# Altium schematic sheet leo_RPI_BUCK.SchDoc
size A; SheetNumber: 4; SheetTotal: 6
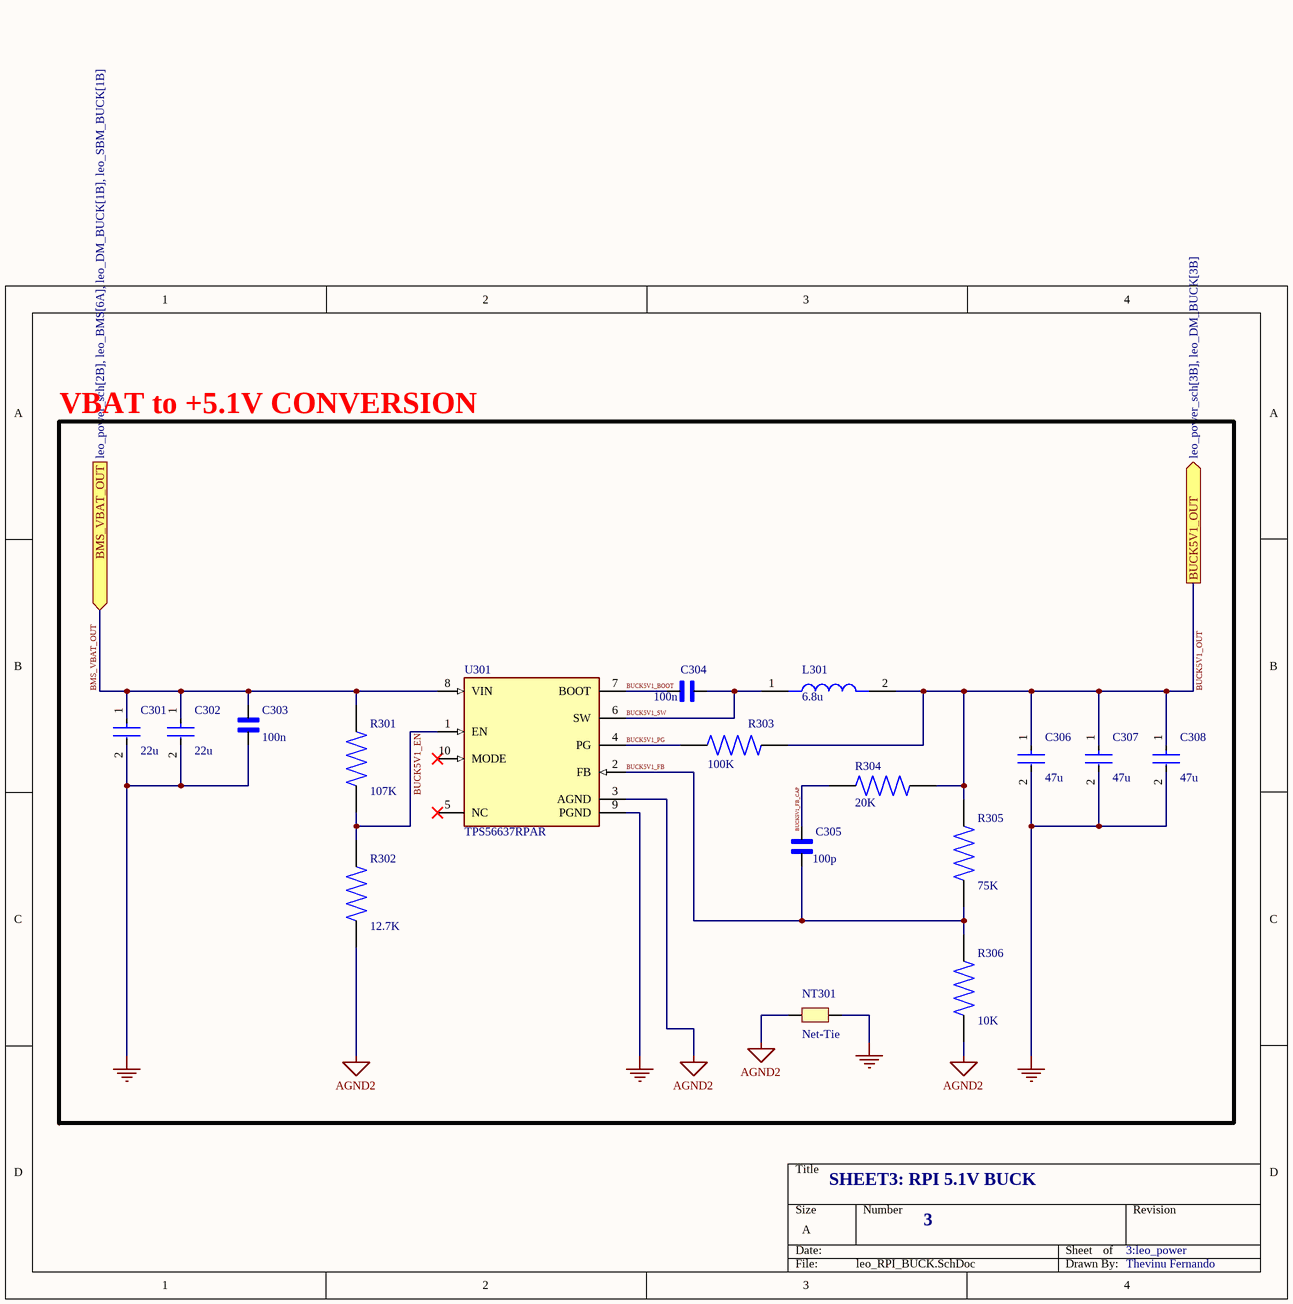
[diagram p0: leo_RPI_BUCK.SchDoc]

## Parts
C301  22u  [CAP_1206]
C302  22u  [CAP_1206]
C303  100n  [CAP_0603]
C304  100n  [CAP_0402]
C305  100p  [CAP_0402]
C306  47u  [CAP_1206]
C307  47u  [CAP_1206]
C308  47u  [CAP_1206]
L301  6.8u  [IND_104CDMCCDS-8R2MC]
NT301  Net-Tie  [NET-TIE_SMD]  (net tie, no BOM)
R301  107K  [RES_0603]
R302  12.7K  [RES_0603]
R303  100K  [RES_0402]
R304  20K  [RES_0402]
R305  75K  [RES_0603]
R306  10K  [RES_0603]
U301  TPS56637RPAR  [FP-RPA0010A-MFG]

## Blocks framed on the sheet
VBAT to +5.1V CONVERSION: C301-C308 L301 NT301 R301-R306 U301

## Ports
BMS_VBAT_OUT (in, see leo_power_sch[2B], leo_BMS[6A], leo_DM_BUCK[1B], leo_SBM_BUCK[1B]), BUCK5V1_OUT (out, see leo_power_sch[3B], leo_DM_BUCK[3B])

## Nets
AGND2: NT301.2 R302.1 R306.1 U301.3(AGND)
GND: C301.2 C302.2 C303.1 C306.2 C307.2 C308.2 NT301.1 U301.9(PGND)
BMS_VBAT_OUT: C301.1 C302.1 C303.2 R301.2 U301.8(VIN) ; port BMS_VBAT_OUT
BUCK5V1_BOOT: C304.1 U301.7(BOOT)
BUCK5V1_EN: R301.1 R302.2 U301.1(EN)
BUCK5V1_FB: C305.1 R305.1 R306.2 U301.2(FB)
BUCK5V1_FB_CAP: C305.2 R304.1
BUCK5V1_OUT: C306.1 C307.1 C308.1 L301.2 R303.2 R304.2 R305.2 ; port BUCK5V1_OUT
BUCK5V1_PG: R303.1 U301.4(PG)
BUCK5V1_SW: C304.2 L301.1 U301.6(SW)

Not connected (* = marked no-connect by the designer): U301 5(NC)* 10(MODE)*

## Notes on the sheet
- SHEET3: RPI 5.1V BUCK
- 3
- 3:leo_power
- Thevinu Fernando

## Library data of the parts
C301 C302 C306-C308 = CAP_1206: Ceramic Capacitor, Multilayer, Ceramic, 25V, 10% +Tol, 10% -Tol, X5R, 15% TC, 22uF, Surface Mount, 1206; Part Number: CL31A226KAHNNNE; Manufacturer: Samsung; Symbol Hash: fb88589c83559698c54462c48d907c3ddae810bd717f4f20b193cecb944ab7ab; Verification Version: 0.0.0.3; Capacitance: 22µF; Mouser Part Number: 187-CL31A226KAHNNNE; Temperature Coefficient: 15%; Temperature Range High: +85°C; Digikey Description: CAP CER 22UF 25V X5R 1206; Digikey Part Number: 1276-3047-1-ND; Tolerance: 10%; ComponentLink2URL: https://product.samsungsem.com/mlcc/CL31A226KAHNNN.do; ComponentLink2Description: Datasheet; Voltage Rating: 25V; Lead Free: Yes; Height: 1.8mm; Temperature Characteristic: X5R; Automotive: No; Package: CL31H-0.2; Temperature Range Low: -55°C; Capacitance: 22uF; RoHS: TRUE; Material: Ceramic; Ipc Land Pattern Name: CAPC320160X160; ComponentLink1Description: Upverter; Supplier 2: Mouser; Supplier 1: Digi-Key; ComponentLink1URL: https://upverter.com/part/id/4e7a76ad8fe2f2e1/; Supplier Part Number 2: 187-CL31A226KAHNNNE; Supplier Part Number 1: 1276-3047-1-ND; Value: 22uF; helpURL: https://upverter.com/part/id/4e7a76ad8fe2f2e1/; Temperature: -55°C to +85°C; RoHS: Compliant; Dielectric: X5R; HelpURL: https://product.samsungsem.com/mlcc/CL31A226KAHNNN.do; Max Operating Temperature: 85°C; Voltage Rating (DC): 25V; ComponentLink2Description: Datasheet URL; Min Operating Temperature: -55°C; Case/Package: 1206
C303 = CAP_0603: Â±10% 50V Ceramic Capacitor X7R 0603 (1608 Metric); MF: Samsung Electro-Mechanics; MP: CL10B104KB8NNNC; SnapEDA_Link: https://www.snapeda.com/parts/CL10B104KB8NNNC/Samsung/view-part/?ref=snap; Package: SMD-2 Samsung; Value: *; Check_prices: https://www.snapeda.com/parts/CL10B104KB8NNNC/Samsung/view-part/?ref=eda
C304 C305 = CAP_0402: ±10% 50V Ceramic Capacitor X7R 0402; MF: Samsung; MP: CL05B104KO5NNNC; SnapEDA_Link: https://www.snapeda.com/parts/CL05B104KO5NNNC/Samsung/view-part/?ref=snap; Package: SMD-2-2 Samsung; Value: *; Check_prices: https://www.snapeda.com/parts/CL05B104KO5NNNC/Samsung/view-part/?ref=eda
L301 = 104CDMCCDS-8R2MC: Inductor Power Shielded/Molded Wirewound 8.2uH 20% 100KHz Metal 8.3A 0.027Ohm DCR 4040 T/R; MF: Sumida; Package: Nonstandard Sumida; Check_prices: https://www.snapeda.com/parts/104CDMCCDS-8R2MC/Sumida/view-part/?ref=eda; Value: *; Price: None; Purchase-URL: https://pricing.snapeda.com/search/part/104CDMCCDS-8R2MC/?ref=eda; MP: 104CDMCCDS-8R2MC; SnapEDA_Link: https://www.snapeda.com/parts/104CDMCCDS-8R2MC/Sumida/view-part/?ref=snap; Availability: In Stock
NT301 = NET-TIE: Single point connection between nets.; MountType: SMT; PackageReference: N/A; CompType: Net-Tie; Library Reference: Net-Tie; Manufacturer: N/A; PartNumber: N/A
R301 R302 R305 R306 = RES_0603: Â±1% 0.1W, 1/10W Chip Resistor 0603 (1608 Metric) Moisture Resistant Thick Film; MF: Yageo; MP: RC0603FR-0791KL; SnapEDA_Link: https://www.snapeda.com/parts/RC0603FR-0791KL/Yageo/view-part/?ref=snap; Package: 1608 Yageo; Value: *; Check_prices: https://www.snapeda.com/parts/RC0603FR-0791KL/Yageo/view-part/?ref=eda
R303 R304 = RES_0402: Chip Resistor 0402 (1005 Metric) Automotive AEC-Q200 Thick Film; MF: Panasonic; MP: ERJ-2RKF1002X; Package: 1005-2 Panasonic; Price: None; Check_prices: https://www.snapeda.com/parts/ERJ-2RKF1002X/Panasonic%20Electronic%20Components/view-part/78636/?ref=eda; Value: *; SnapEDA_Link: https://www.snapeda.com/parts/ERJ-2RKF1002X/Panasonic%20Electronic%20Components/view-part/78636/?ref=snap; Availability: In Stock
U301 = TPS56637RPAR: Buck Switching Regulator IC Adjustable 0.6V~13V 1 Output 6A VQFN-10-HR(3x3); Manufacturer: Texas Instruments; Max Duty Cycle: 91%; Nominal Supply Current: 140uA; Max Supply Voltage: 28V; Switching Frequency: 500kHz; Output Type: AdjustableProgrammable; Max Junction Temp: +150°C; Output Voltage: 0.6-13V; Standoff Height: 0mm; Number Of Outputs: 1; Min Supply Voltage: 4.5V; Automotive: No; Manufacturer Part Number: TPS56637RPAR; Lead Free: Yes; Temperature Range Low: -40°C; Digikey Description: IC POWER MANAGEMENT; Octopart: https://octopart.com/tps56637rpar-texas+instruments-97650653; Output Current: 6A; Temperature: -40°C to +150°C; Device Class L3: Voltage Regulators - Switching; Temperature Range High: +150°C; Package: RPA0010A; Device Class L2: Power Management ICs; ComponentLink2URL: http://www.ti.com/lit/ds/symlink/tps56637.pdf; Device Class L1: Integrated Circuits (ICs); Switching Topology: Buck; RoHS: TRUE; ComponentLink2Description: Datasheet; Height: 1mm; Category: IC